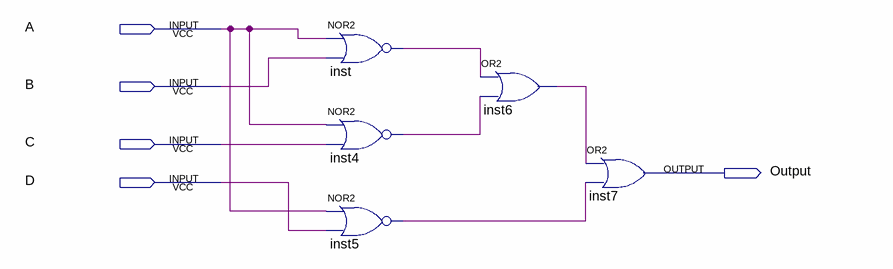
[diagram p0: schematic sheet]
// Quartus schematic lab_week_3.bdf as structural Verilog: 5 symbols, 5 pins
module lab_week_3 (
  input  A,
  input  B,
  input  C,
  input  D,
  output Output
);

  wire inst4_out, inst5_out, inst6_out, inst_out;

  nor inst (inst_out, A, B);
  nor inst4 (inst4_out, A, C);
  nor inst5 (inst5_out, A, D);
  or inst6 (inst6_out, inst_out, inst4_out);
  or inst7 (Output, inst6_out, inst5_out);
endmodule
